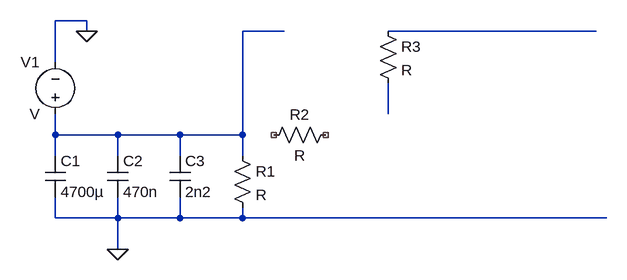
[diagram p0: schematic Draft1.asc]
Draft1.asc, the LTspice schematic file:
Version 4.1
SHEET 1 880 680
WIRE -16 -144 -64 -144
WIRE -16 -128 -16 -144
WIRE 288 -128 224 -128
WIRE 768 -128 448 -128
WIRE -64 -80 -64 -144
WIRE 448 0 448 -48
WIRE -64 32 -64 0
WIRE 32 32 -64 32
WIRE 128 32 32 32
WIRE 224 32 224 -128
WIRE 224 32 128 32
WIRE -64 64 -64 32
WIRE 32 64 32 32
WIRE 128 64 128 32
WIRE 224 64 224 32
WIRE -64 160 -64 128
WIRE 32 160 32 128
WIRE 32 160 -64 160
WIRE 128 160 128 128
WIRE 128 160 32 160
WIRE 224 160 224 144
WIRE 224 160 128 160
WIRE 784 160 224 160
WIRE 32 208 32 160
FLAG -16 -128 0
FLAG 32 208 0
SYMBOL voltage -64 16 R180
WINDOW 0 24 96 Left 2
WINDOW 3 24 16 Left 2
SYMATTR InstName V1
SYMBOL cap -80 64 R0
SYMATTR InstName C1
SYMATTR Value 4700µ
SYMBOL cap 16 64 R0
SYMATTR InstName C2
SYMATTR Value 470n
SYMBOL cap 112 64 R0
SYMATTR InstName C3
SYMATTR Value 2n2
SYMBOL res 208 48 R0
SYMATTR InstName R1
SYMBOL res 432 -144 R0
SYMATTR InstName R3
SYMBOL res 368 16 R90
WINDOW 0 0 56 VBottom 2
WINDOW 3 32 56 VTop 2
SYMATTR InstName R2

The netlist it stands for:
* Draft1.asc
V1 N001 0 V
C1 N001 0 4700µ
C2 N001 0 470n
C3 N001 0 2n2
R1 N001 0 R
R3 N002 N003 R
R2 NC_01 NC_02 R
.backanno
.end